# Altium schematic sheet 12VoltRegulator.SchDoc
size A
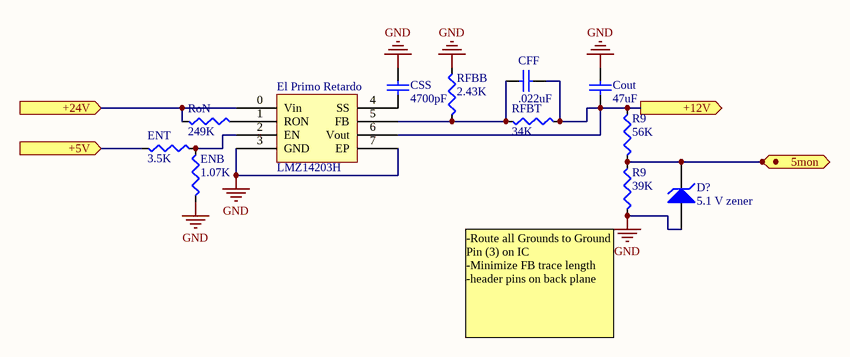
[diagram p0: 12VoltRegulator.SchDoc]

## Parts
(Parts that share a designator on the sheet are numbered #1, #2 ... from top to bottom, then left to right.)
CFF  .022uF  [0805 (2012) Capacitor]
Cout  47uF  [0805 (2012) Capacitor]
CSS  4700pF  [0805 (2012) Capacitor]
D?  5.1 V zener  [DIODE-0.7]
El_Primo_Retardo  LMZ14203H  [LMZ14203H]
ENB  1.07K  [R 0805 (2012) RESISTOR]
ENT  3.5K  [R 0805 (2012) RESISTOR]
R9#1  56K  [R 0805 (2012) RESISTOR]
R9#2  39K  [R 0805 (2012) RESISTOR]
RFBB  2.43K  [R 0805 (2012) RESISTOR]
RFBT  34K  [R 0805 (2012) RESISTOR]
RoN  249K  [R 0805 (2012) RESISTOR]

## Ports
5mon (out), +5V (in), +12V (out), +24V (in)

## Nets
GND: Cout.2 CSS.2 D?.1(A) El_Primo_Retardo.3(GND) El_Primo_Retardo.7(EP) ENB.1 R9#2.1 RFBB.2
5mon: D?.2(K) R9#1.2 R9#2.2 ; port 5mon
+5V: ENT.2 ; port +5V
+12V: CFF.1 Cout.1 El_Primo_Retardo.6(Vout) R9#1.1 RFBT.1 ; port +12V
+24V: El_Primo_Retardo.0(Vin) RoN.2 ; port +24V
NetCFF_2: CFF.2 El_Primo_Retardo.5(FB) RFBB.1 RFBT.2
NetCSS_1: CSS.1 El_Primo_Retardo.4(SS)
NetEl_Primo_Retardo_1: El_Primo_Retardo.1(RON) RoN.1
NetEl_Primo_Retardo_2: El_Primo_Retardo.2(EN) ENB.2 ENT.1

## Notes on the sheet
- (near R9#2) -Route all Grounds to Ground Pin (3) on IC
  -Minimize FB trace length
  -header pins on back plane

## Library data of the parts
CFF Cout CSS = Capacitor (non-polarized): Capacitor; Value: .1uF
D? = D Zener: Zener Diode; Published: 8-Jun-2000; LatestRevisionDate: 17-Jul-2002; LatestRevisionNote: Re-released for DXP Platform.; PackageReference: DIODE-0.7; Publisher: Altium Limited; PackageDescription: Diode, Thru-Hole; 2 Leads; 0.7 in Pin Spacing
El_Primo_Retardo = LMZ14203
ENB ENT R9#1 R9#2 RFBB RFBT RoN = Resistor: Value: 0Ohm